# EAGLE design ADC Cubesat v1.1 (EAGLE 9.0.0)
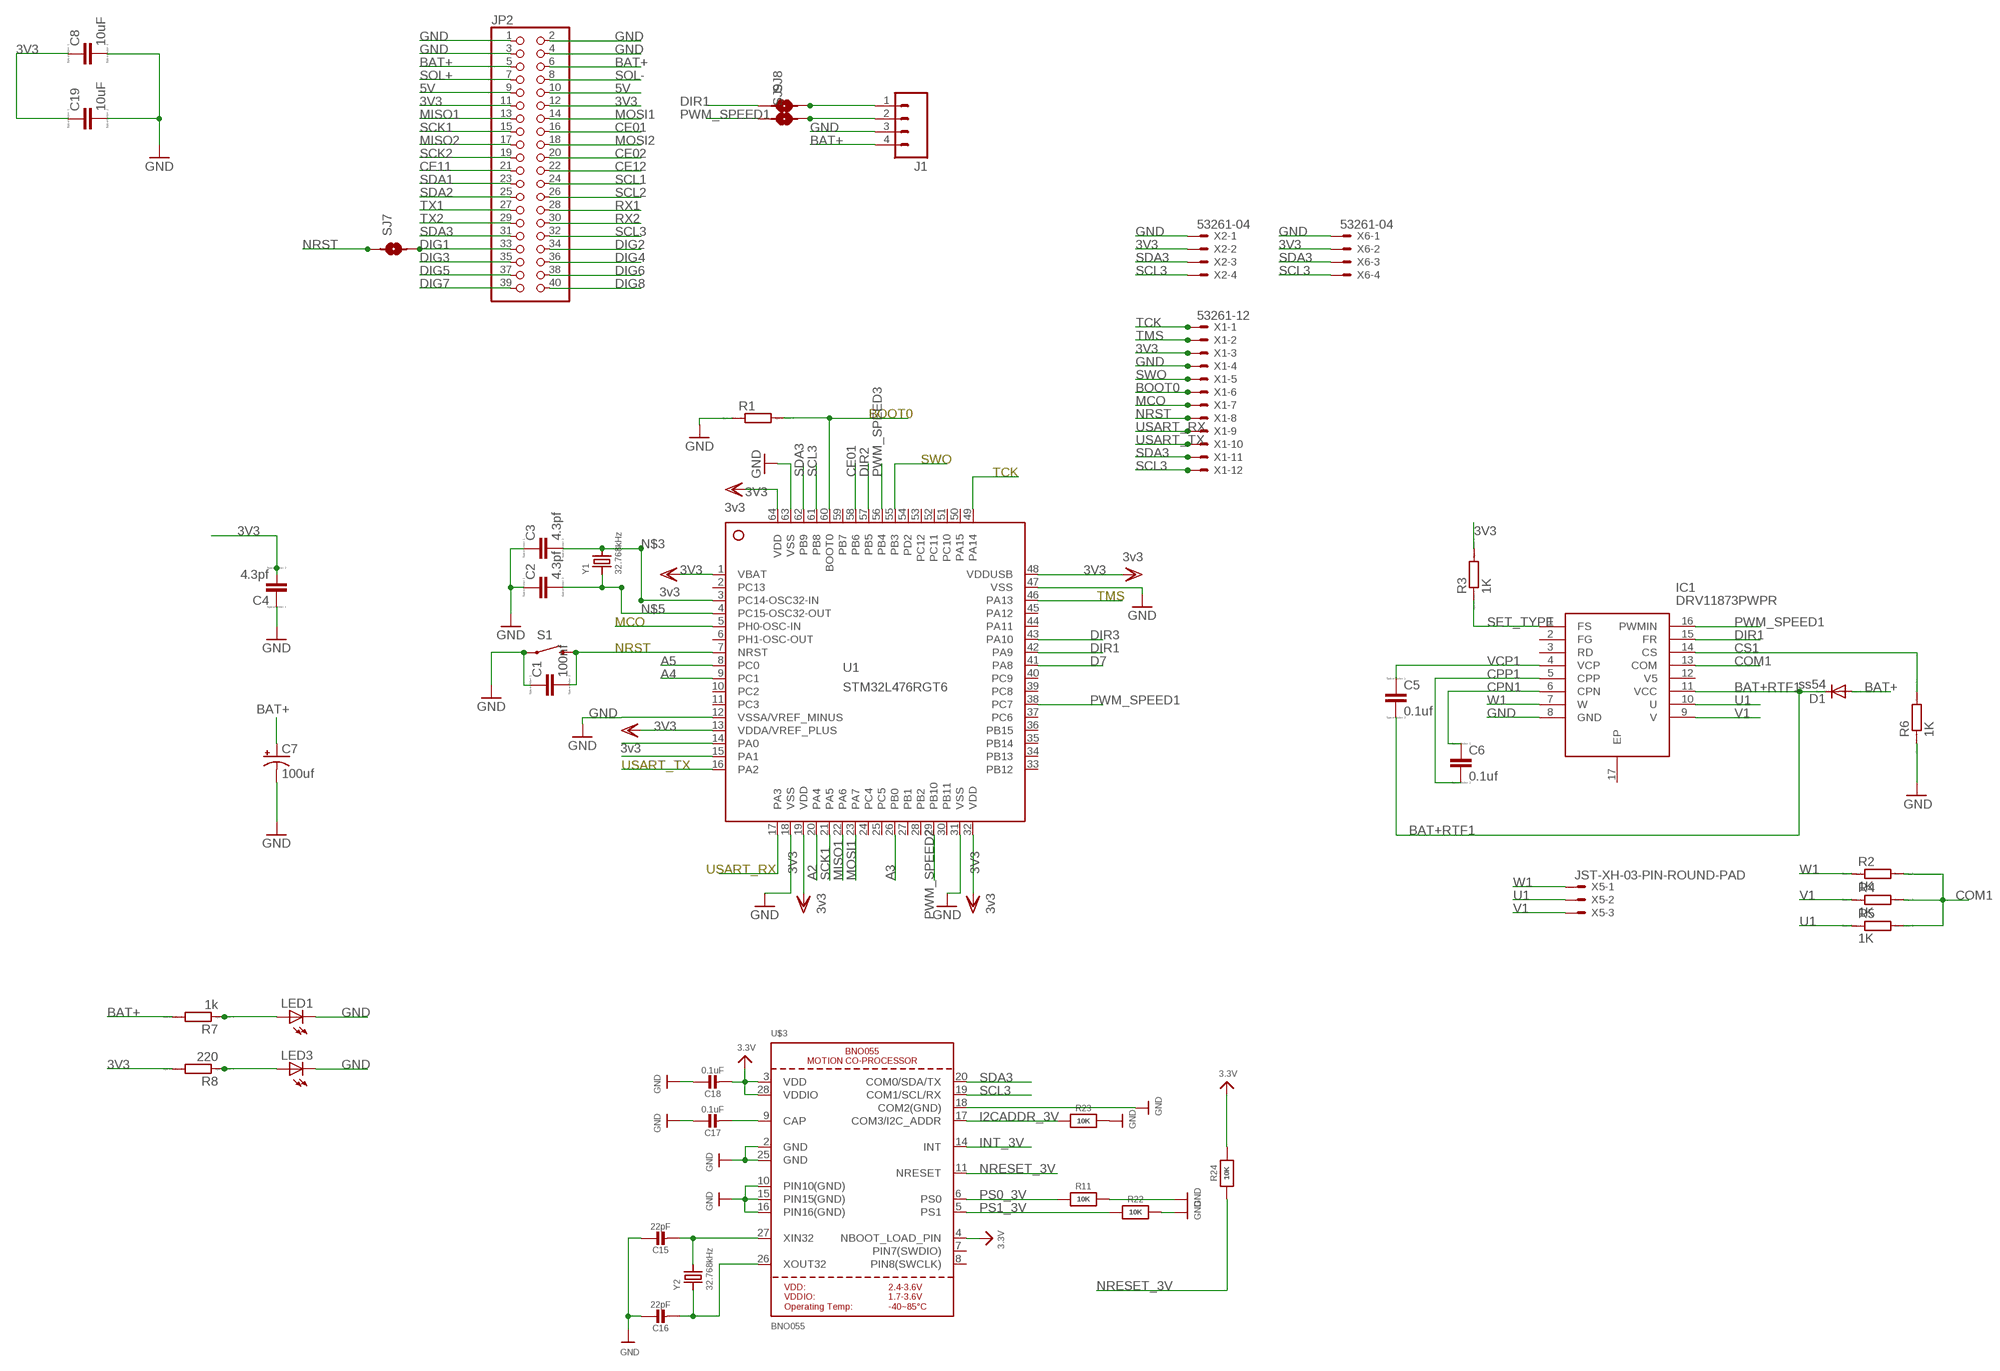
[diagram p0: schematic, sheet 1, part 1 of 2]
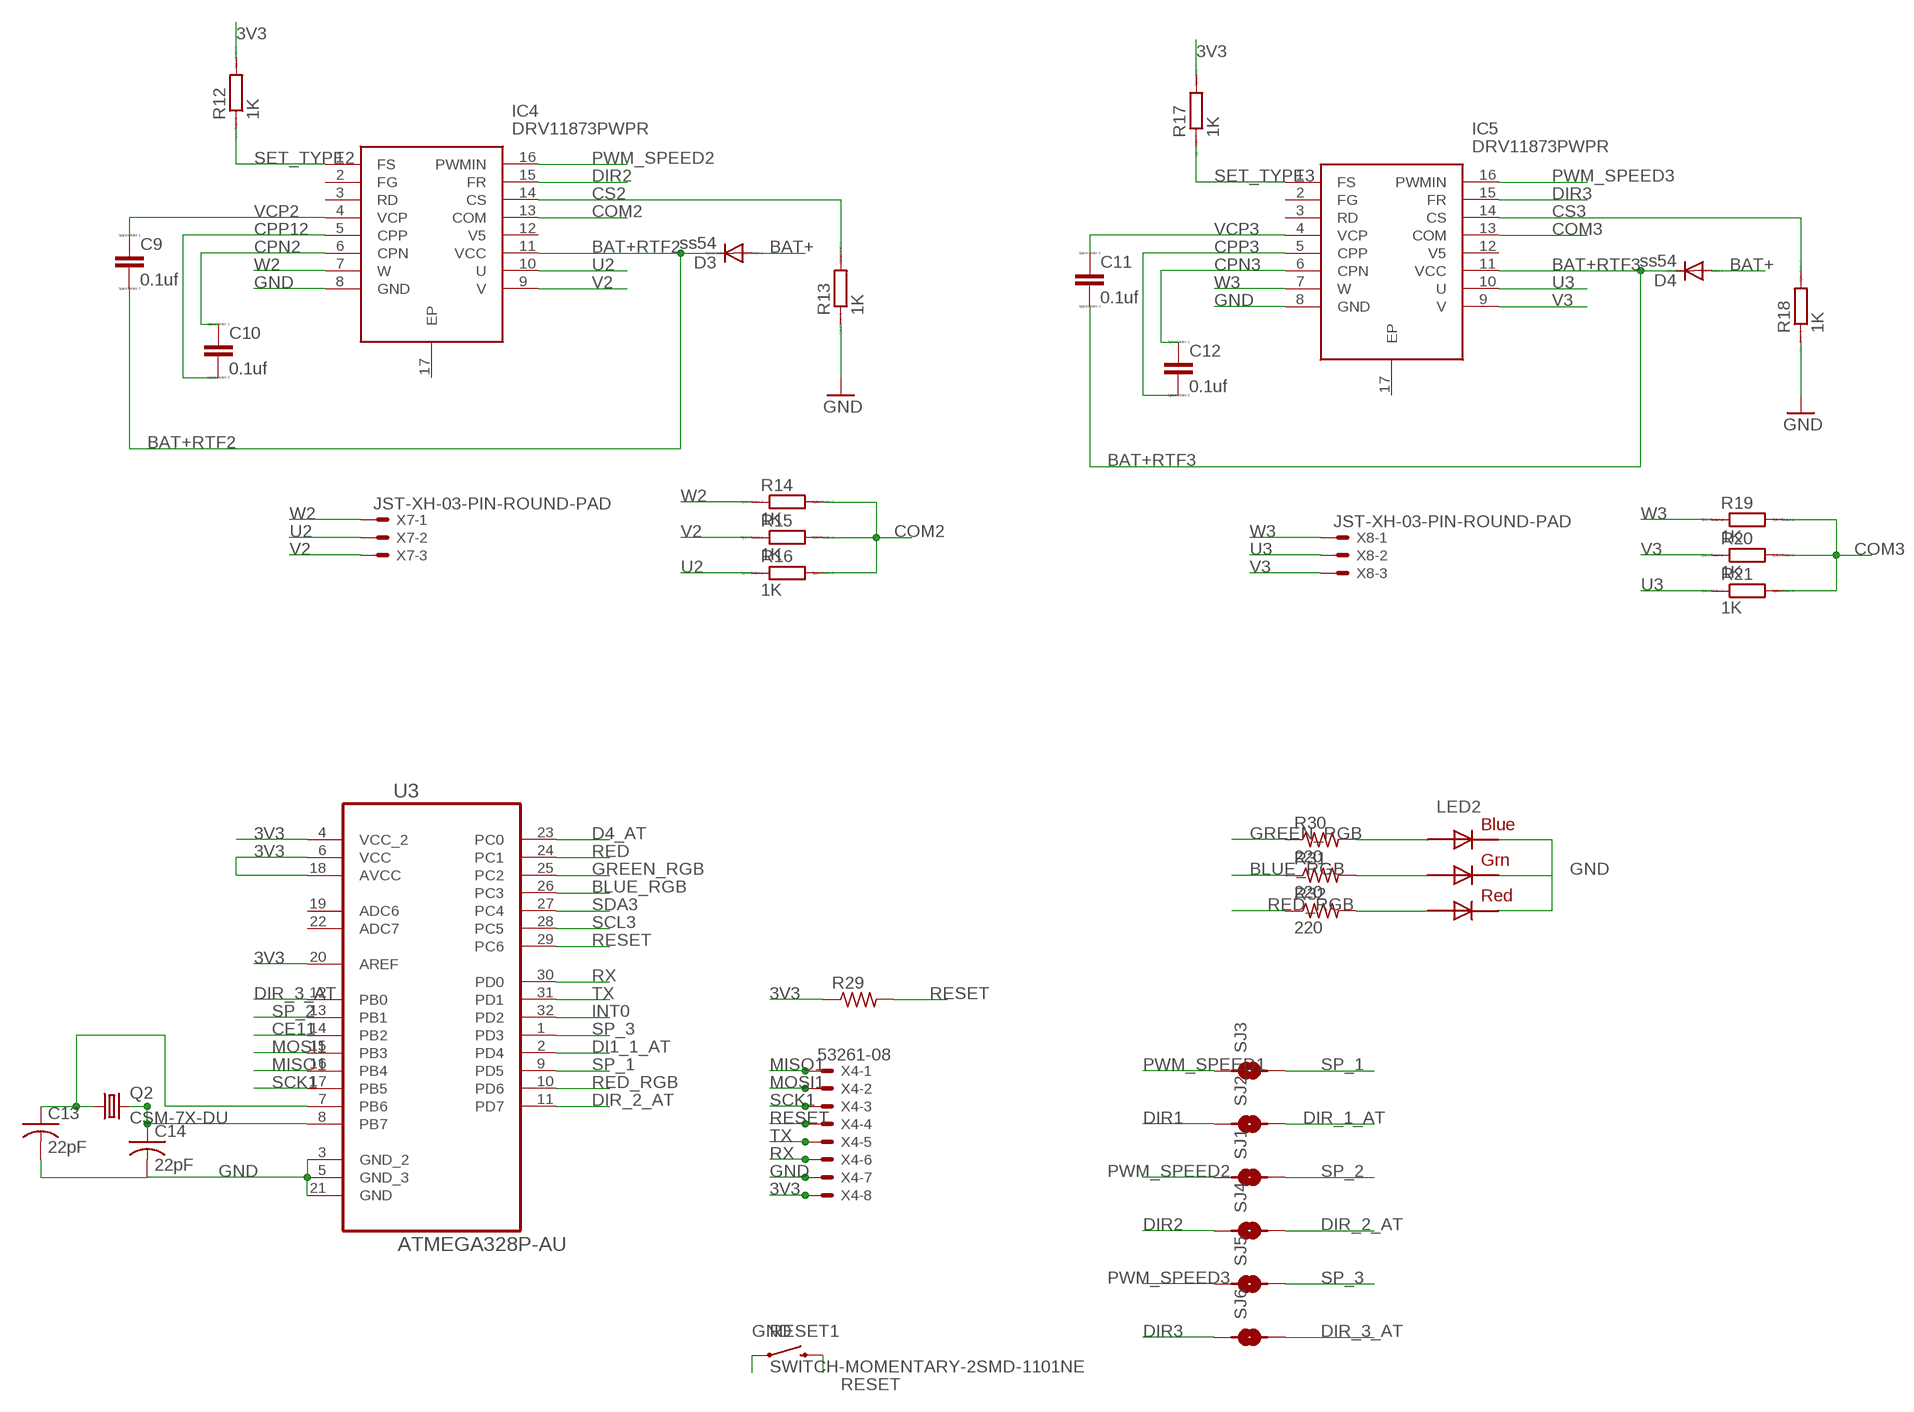
[diagram p1: schematic, sheet 1, part 2 of 2]

## Parts
C1  100nf  CC1206  [C1206]
C2  4.3pf  CC1206  [C1206]
C3  4.3pf  CC1206  [C1206]
C4  4.3pf  CC1206  [C1206]
C5  0.1uf  CC1210  [C1210]
C6  0.1uf  CC1210  [C1210]
C7  100uf  CAP_POLC  [PANASONIC_C]
C8  10uF  CC1206  [C1206]
C9  0.1uf  CC1210  [C1210]
C10  0.1uf  CC1210  [C1210]
C11  0.1uf  CC1210  [C1210]
C12  0.1uf  CC1210  [C1210]
C13  22pF  C-USC0603  [C0603]
C14  22pF  C-USC0603  [C0603]
C15  22pF  CAP_CERAMIC0805-NOOUTLINE  [0805-NO]
C16  22pF  CAP_CERAMIC0805-NOOUTLINE  [0805-NO]
C17  0.1uF  CAP_CERAMIC0805-NOOUTLINE  [0805-NO]
C18  0.1uF  CAP_CERAMIC0805_10MGAP  [0805_10MGAP]
C19  10uF  CC1206  [C1206]
D1  ss54  DIODE-DO-214AC  [DO-214AC]
D3  ss54  DIODE-DO-214AC  [DO-214AC]
D4  ss54  DIODE-DO-214AC  [DO-214AC]
IC1  DRV11873PWPR  [SOP65P640X120-17N]
IC4  DRV11873PWPR  [SOP65P640X120-17N]
IC5  DRV11873PWPR  [SOP65P640X120-17N]
J1  M04JST-PTH-VERT  [JST-4-PTH-VERT]
JP2  PINHD-2X20  [2X20]
LED1  LEDSML1206  [SML1206]
LED2  RGBLED5050  [RGBLED5050]
LED3  LEDSML1206  [SML1206]
Q2  CSM-7X-DU  [CSM-7X-DU]
R1  RR1206  [R1206]
R2  1K  RR1206  [R1206]
R3  1K  RR1206  [R1206]
R4  1K  RR1206  [R1206]
R5  1K  RR1206  [R1206]
R6  1K  RR1206  [R1206]
R7  1k  RR1206  [R1206]
R8  220  RR1206  [R1206]
R11  10K  RESISTOR0805_NOOUTLINE  [0805-NO]
R12  1K  RR1206  [R1206]
R13  1K  RR1206  [R1206]
R14  1K  RR1206  [R1206]
R15  1K  RR1206  [R1206]
R16  1K  RR1206  [R1206]
R17  1K  RR1206  [R1206]
R18  1K  RR1206  [R1206]
R19  1K  RR1206  [R1206]
R20  1K  RR1206  [R1206]
R21  1K  RR1206  [R1206]
R22  10K  RESISTOR0805_NOOUTLINE  [0805-NO]
R23  10K  RESISTOR0805_NOOUTLINE  [0805-NO]
R24  10K  RESISTOR0805_NOOUTLINE  [0805-NO]
R29  R-US_M1206  [M1206]
R30  220  R-US_R0603  [R0603]
R31  220  R-US_R0603  [R0603]
R32  220  R-US_R0603  [R0603]
RESET1  SWITCH-MOMENTARY-2SMD-1101NE  [TACTILE-SWITCH-1101NE]
S1  .  SWITCH-MOMENTARY-2SMD-1101NE  [TACTILE-SWITCH-1101NE]
SJ1  SMD-JUMPER-2  [SMD-JUMPER-2]
SJ2  SMD-JUMPER-2  [SMD-JUMPER-2]
SJ3  SMD-JUMPER-2  [SMD-JUMPER-2]
SJ4  SMD-JUMPER-2  [SMD-JUMPER-2]
SJ5  SMD-JUMPER-2  [SMD-JUMPER-2]
SJ6  SMD-JUMPER-2  [SMD-JUMPER-2]
SJ7  SMD-JUMPER-2  [SMD-JUMPER-2]
SJ8  SMD-JUMPER-2  [SMD-JUMPER-2]
SJ9  SMD-JUMPER-2  [SMD-JUMPER-2]
U1  STM32L476RGT6  [LQFP64_10X10]
U3  ATMEGA328P-AU  [QFP80P900X900X120-32N]
U$3  BNO055  [BNO055]
X1  53261-12  [53261-12]
X2  53261-04  [53261-04]
X4  53261-08  [53261-08]
X5  JST-XH-03-PIN-ROUND-PAD  [JST-XH-03-PACKAGE-ROUND-PAD]
X6  53261-04  [53261-04]
X7  JST-XH-03-PIN-ROUND-PAD  [JST-XH-03-PACKAGE-ROUND-PAD]
X8  JST-XH-03-PIN-ROUND-PAD  [JST-XH-03-PACKAGE-ROUND-PAD]
Y1  32.768kHz  CRYSTAL8.0X3.8  [CRYSTAL_8X3.8]
Y2  32.768kHz  CRYSTAL8.0X3.8  [CRYSTAL_8X3.8]

## Nets
3V3: C4.2 C8.1 C18.2 C19.1 JP2.11 JP2.12 R3.2 R8.2 R12.2 R17.2 R24.2 R29.1 U1.1(VBAT) U1.13(VDDA/VREF_PLUS) U1.19(VDD) U1.32(VDD) U1.48(VDDUSB) U1.64(VDD) U3.4(VCC_2) U3.6(VCC) U3.18(AVCC) U3.20(AREF) U$3.3(VDD) U$3.4(NBOOT_LOAD_PIN) U$3.28(VDDIO) X1.3 X2.2 X4.8 X6.2 ; supply symbol labelled 3v3, 3.3V
5V: JP2.9 JP2.10
A2: U1.20(PA4)
A3: U1.26(PB0)
A4: U1.9(PC1)
A5: U1.8(PC0)
BAT+: C7.+ D1.A D3.A D4.A J1.4 JP2.5 JP2.6 R7.2
BAT+RTF1: C5.2 D1.C IC1.11(VCC)
BAT+RTF2: C9.2 D3.C IC4.11(VCC)
BAT+RTF3: C11.2 D4.C IC5.11(VCC)
BLUE_RGB: R31.1 U3.26(PC3)
BOOT0: R1.2 U1.60(BOOT0) X1.6
CE01: JP2.16 U1.58(PB6)
CE02: JP2.20
CE11: JP2.21 U3.14(PB2)
CE12: JP2.22
COM1: IC1.13(COM) R2.2 R4.2 R5.2
COM2: IC4.13(COM) R14.2 R15.2 R16.2
COM3: IC5.13(COM) R19.2 R20.2 R21.2
CPN1: C6.1 IC1.6(CPN)
CPN2: C10.1 IC4.6(CPN)
CPN3: C12.1 IC5.6(CPN)
CPP1: C6.2 IC1.5(CPP)
CPP3: C12.2 IC5.5(CPP)
CPP12: C10.2 IC4.5(CPP)
CS1: IC1.14(CS) R6.2
CS2: IC4.14(CS) R13.2
CS3: IC5.14(CS) R18.2
D4_AT: U3.23(PC0)
D7: U1.41(PA8)
DI1_1_AT: U3.2(PD4)
DIG1: JP2.33 SJ7.2
DIG2: JP2.34
DIG3: JP2.35
DIG4: JP2.36
DIG5: JP2.37
DIG6: JP2.38
DIG7: JP2.39
DIG8: JP2.40
DIR1: IC1.15(FR) SJ2.1 SJ8.1 U1.42(PA9)
DIR2: IC4.15(FR) SJ4.1 U1.57(PB5)
DIR3: IC5.15(FR) SJ6.1 U1.43(PA10)
DIR_1_AT: SJ2.2
DIR_2_AT: SJ4.2 U3.11(PD7)
DIR_3_AT: SJ6.2 U3.12(PB0)
GND: C1.1 C2.1 C3.1 C4.1 C7.- C8.2 C13.2 C14.2 C15.1 C16.1 C17.1 C18.1 C19.2 IC1.8(GND) IC4.8(GND) IC5.8(GND) J1.3 JP2.1 JP2.2 JP2.3 JP2.4 LED1.C LED2.4(BLUE_C) LED2.5(RED_C) LED2.6(GREEN_C) LED3.C R1.1 R6.1 R11.2 R13.1 R18.1 R22.2 RESET1.1 S1.1 U1.12(VSSA/VREF_MINUS) U1.18(VSS) U1.31(VSS) U1.47(VSS) U1.63(VSS) U3.3(GND_2) U3.5(GND_3) U3.21(GND) U$3.2(GND) U$3.10(PIN10(GND)) U$3.15(PIN15(GND)) U$3.16(PIN16(GND)) U$3.18(COM2(GND)) U$3.25(GND) X1.4 X2.1 X4.7 X6.1
GREEN_RGB: R30.1 U3.25(PC2)
I2CADDR_3V: R23.1 U$3.17(COM3/I2C_ADDR)
INT0: U3.32(PD2)
INT_3V: U$3.14(INT)
MCO: U1.5(PH0-OSC-IN) X1.7
MISO1: JP2.13 U1.22(PA6) U3.16(PB4) X4.1
MISO2: JP2.17
MOSI1: JP2.14 U1.23(PA7) U3.15(PB3) X4.2
MOSI2: JP2.18
N$1: U1.14(PA0)
N$2: U1.15(PA1)
N$3: C3.2 U1.3(PC14-OSC32-IN) Y1.P$4
N$4: J1.1 SJ8.2
N$5: C2.2 U1.4(PC15-OSC32-OUT) Y1.P$1
N$6: J1.2 SJ9.2
N$7: LED1.A R7.1
N$8: C14.1 Q2.2 U3.8(PB7)
N$9: C15.2 U$3.27(XIN32) Y2.P$4
N$10: C16.2 U$3.26(XOUT32) Y2.P$1
N$11: C17.2 U$3.9(CAP)
N$12: C13.1 Q2.1 U3.7(PB6)
N$13: LED2.3(BLUE_A) R30.2
N$14: LED2.1(GREEN_A) R31.2
N$15: LED2.2(RED_A) R32.2
N$16: LED3.A R8.1
NRESET_3V: R24.1 U$3.11(NRESET)
NRST: C1.2 S1.2 SJ7.1 U1.7(NRST) X1.8
PS0_3V: R11.1 U$3.6(PS0)
PS1_3V: R22.1 U$3.5(PS1)
PWM_SPEED1: IC1.16(PWMIN) SJ3.1 SJ9.1 U1.38(PC7)
PWM_SPEED2: IC4.16(PWMIN) SJ1.1 U1.29(PB10)
PWM_SPEED3: IC5.16(PWMIN) SJ5.1 U1.56(PB4)
RED: U3.24(PC1)
RED_RGB: R32.1 U3.10(PD6)
RESET: R29.2 RESET1.2 U3.29(PC6) X4.4
RX: U3.30(PD0) X4.6
RX1: JP2.28
RX2: JP2.30
SCK1: JP2.15 U1.21(PA5) U3.17(PB5) X4.3
SCK2: JP2.19
SCL1: JP2.24
SCL2: JP2.26
SCL3: JP2.32 U1.61(PB8) U3.28(PC5) U$3.19(COM1/SCL/RX) X1.12 X2.4 X6.4
SDA1: JP2.23
SDA2: JP2.25
SDA3: JP2.31 U1.62(PB9) U3.27(PC4) U$3.20(COM0/SDA/TX) X1.11 X2.3 X6.3
SET_TYPE: IC1.1(FS) R3.1
SET_TYPE2: IC4.1(FS) R12.1
SET_TYPE3: IC5.1(FS) R17.1
SOL+: JP2.7
SOL-: JP2.8
SP_1: SJ3.2 U3.9(PD5)
SP_2: SJ1.2 U3.13(PB1)
SP_3: SJ5.2 U3.1(PD3)
SWO: U1.55(PB3) X1.5
TCK: U1.49(PA14) X1.1
TMS: U1.46(PA13) X1.2
TX: U3.31(PD1) X4.5
TX1: JP2.27
TX2: JP2.29
U1: IC1.10(U) R5.1 X5.2
U2: IC4.10(U) R16.1 X7.2
U3: IC5.10(U) R21.1 X8.2
USART_RX: U1.17(PA3) X1.9
USART_TX: U1.16(PA2) X1.10
V1: IC1.9(V) R4.1 X5.3
V2: IC4.9(V) R15.1 X7.3
V3: IC5.9(V) R20.1 X8.3
VCP1: C5.1 IC1.4(VCP)
VCP2: C9.1 IC4.4(VCP)
VCP3: C11.1 IC5.4(VCP)
W1: IC1.7(W) R2.1 X5.1
W2: IC4.7(W) R14.1 X7.1
W3: IC5.7(W) R19.1 X8.1
Unconnected: IC1.2(FG) IC1.3(RD) IC1.12(V5) IC1.17(EP) IC4.2(FG) IC4.3(RD) IC4.12(V5) IC4.17(EP) IC5.2(FG) IC5.3(RD) IC5.12(V5) IC5.17(EP) R23.2 U1.2(PC13) U1.6(PH1-OSC-OUT) U1.10(PC2) U1.11(PC3) U1.24(PC4) U1.25(PC5) U1.27(PB1) U1.28(PB2) U1.30(PB11) U1.33(PB12) U1.34(PB13) U1.35(PB14) U1.36(PB15) U1.37(PC6) U1.39(PC8) U1.40(PC9) U1.44(PA11) U1.45(PA12) U1.50(PA15) U1.51(PC10) U1.52(PC11) U1.53(PC12) U1.54(PD2) U1.59(PB7) U3.19(ADC6) U3.22(ADC7) U$3.7(PIN7(SWDIO)) U$3.8(PIN8(SWCLK))

## Library data of the parts
C1-C6 C8-C12 C19 = eagle-ltspice:C: CAPACITOR, European symbol; SPICEMODEL: NONE; SPICEPREFIX: C
C7 = SparkFun-Capacitors:CAP_POL: Capacitor Polarized These are standard SMD and PTH capacitors. Normally 10uF, 47uF, and 100uF in electrolytic and tantalum varieties. Always verify the external diameter of the through hole cap, it varies with capacity, voltage, and manufacturer. The EIA devices should be standard.
C13 C14 = rcl:C-US: CAPACITOR, American symbol
C15-C18 = microbuilder:CAP_CERAMIC: Ceramic Capacitors For new designs, use the packages preceded by an '_' character since they are more reliable: The following footprints should be used on most boards: _0402 - Standard footprint for regular board layouts _0603 - Standard footprint for regular board layouts _0805 - Standard footprint for regular board layouts _1206 - Standard footprint for regular board layouts For extremely tight-pitch boards where space is at a premium, the following 'micro-pitch' footprints can be used (smaller pads, no silkscreen outline, etc.): _0402MP - Micro-pitch footprint for very dense/compact boards _0603MP - Micro-pitch footprint for very dense/compact boards _0805MP - Micro-pitch footprint for very dense/compact boards _1206MP - Micro-pitch footprint for very dense/compact boards
D1 D3 D4 = diode:DIODE-: DIODE
IC1 IC4 IC5 = DRV11873PWPR:DRV11873PWPR: 3-Ph Sensorless BLDC Motor Driver HTSSOP Texas Instruments DRV11873PWPR BLDC Motor Driver IC, 16 V 1.5A, 16-Pin HTSSOP Source: Datasheet <https://componentsearchengine.com/Datasheets/1/DRV11873PWPR.pdf>; ARROW_PART_NUMBER: DRV11873PWPR; ARROW_PRICE/STOCK: https://www.arrow.com/en/products/drv11873pwpr/texas-instruments; DESCRIPTION: 3-Ph Sensorless BLDC Motor Driver HTSSOP Texas Instruments DRV11873PWPR BLDC Motor Driver IC, 16 V 1.5A, 16-Pin HTSSOP; HEIGHT: 1.2mm; MANUFACTURER_NAME: Texas Instruments; MANUFACTURER_PART_NUMBER: DRV11873PWPR; RS_PART_NUMBER: 1627666; RS_PRICE/STOCK: http://uk.rs-online.com/web/p/products/1627666
J1 = SparkFun-Connectors:M04: Header 4 Standard 4-pin 0.1" header. Use with straight break away headers (SKU : PRT-00116), right angle break away headers (PRT-00553), swiss pins (PRT-00743), machine pins (PRT-00117), and female headers (PRT-00115). Molex polarized connector foot print use with SKU : PRT-08231 with associated crimp pins and housings. 1MM SMD Version SKU: PRT-10208; PROD_ID: CONN-13251
JP2 = pinhead:PINHD-2X20: PIN HEADER
LED1 LED3 = led:LED: LED OSRAM: - CHIPLED LG R971, LG N971, LY N971, LG Q971, LY Q971, LO R971, LY R971 LH N974, LH R974 LS Q976, LO Q976, LY Q976 LO Q996 - Hyper CHIPLED LW Q18S LB Q993, LB Q99A, LB R99A - SideLED LS A670, LO A670, LY A670, LG A670, LP A670 LB A673, LV A673, LT A673, LW A673 LH A674 LY A675 LS A676, LA A676, LO A676, LY A676, LW A676 LS A679, LY A679, LG A679 - Hyper Micro SIDELED® LS Y876, LA Y876, LO Y876, LY Y876 LT Y87S - SmartLED LW L88C, LW L88S LB L89C, LB L89S, LG L890 LS L89K, LO L89K, LY L89K LS L896, LA L896, LO L896, LY L896 - TOPLED LS T670, LO T670, LY T670, LG T670, LP T670 LSG T670, LSP T670, LSY T670, LOP T670, LYG T670 LG T671, LOG T671, LSG T671 LB T673, LV T673, LT T673, LW T673 LH T674 LS T676, LA T676, LO T676, LY T676, LB T676, LH T676, LSB T676, LW T676 LB T67C, LV T67C, LT T67C, LS T67K, LO T67K, LY T67K, LW E67C LS E67B, LA E67B, LO E67B, LY E67B, LB E67C, LV E67C, LT E67C LW T67C LS T679, LY T679, LG T679 LS T770, LO T770, LY T770, LG T770, LP T770 LB T773, LV T773, LT T773, LW T773 LH T774 LS E675, LA E675, LY E675, LS T675 LS T776, LA T776, LO T776, LY T776, LB T776 LHGB T686 LT T68C, LB T68C - Hyper Mini TOPLED® LB M676 - Mini TOPLED Santana® LG M470 LS M47K, LO M47K, LY M47K Source: http://www.osram.convergy.de LUXEON: - LUMILED® LXK2-PW12-R00, LXK2-PW12-S00, LXK2-PW14-U00, LXK2-PW14-V00 LXK2-PM12-R00, LXK2-PM12-S00, LXK2-PM14-U00 LXK2-PE12-Q00, LXK2-PE12-R00, LXK2-PE12-S00, LXK2-PE14-T00, LXK2-PE14-U00 LXK2-PB12-K00, LXK2-PB12-L00, LXK2-PB12-M00, LXK2-PB14-N00, LXK2-PB14-P00, LXK2-PB14-Q00 LXK2-PR12-L00, LXK2-PR12-M00, LXK2-PR14-Q00, LXK2-PR14-R00 LXK2-PD12-Q00, LXK2-PD12-R00, LXK2-PD12-S00 LXK2-PH12-R00, LXK2-PH12-S00 LXK2-PL12-P00, LXK2-PL12-Q00, LXK2-PL12-R00 Source: www.luxeon.com KINGBRIGHT: KA-3528ASYC Source: www.kingbright.com
LED2 = adafruit:RGBLED: For 5050 RGB LEDs, the order of the LEDs may vary from one manufacturer to another!
Q2 = crystal:CSM-7X-DU: SMD CRYSTAL Source: www.ecsxtal.com .. Crystal 3.6864MHz CSM_7X_DU.PDF; OC_FARNELL: unknown; OC_NEWARK: unknown
R1-R8 R12-R21 = eagle-ltspice:R: RESISTOR, European symbol; SPICEMODEL: NONE; SPICEPREFIX: R
R11 R22-R24 = microbuilder:RESISTOR: Resistors For new designs, use the packages preceded by an '_' character since they are more reliable: The following footprints should be used on most boards: _0402 - Standard footprint for regular board layouts _0603 - Standard footprint for regular board layouts _0805 - Standard footprint for regular board layouts _1206 - Standard footprint for regular board layouts For extremely tight-pitch boards where space is at a premium, the following 'micro-pitch' footprints can be used (smaller pads, no silkscreen outline, etc.): _0402MP - Micro-pitch footprint for very dense/compact boards _0603MP - Micro-pitch footprint for very dense/compact boards _0805MP - Micro-pitch footprint for very dense/compact boards _1206MP - Micro-pitch footprint for very dense/compact boards
R29-R32 = adafruit:R-US_: RESISTOR, American symbol
RESET1 S1 = SparkFun-Electromechanical:SWITCH-MOMENTARY-2: Various NO switches- pushbuttons, reed, etc; PROD_ID: SWCH-00815
SJ1-SJ9 = FaBo-etc:SMD-JUMPER-2
U1 = STM32L4xxx:STM32L476R*: STM32L476RX LQFP100 Datasheet STM32L476XX <http://www.st.com/content/ccc/resource/technical/document/datasheet/c5/ed/2f/60/aa/79/42/0b/DM00108832.pdf/files/DM00108832.pdf/jcr:content/translations/en.DM00108832.pdf>; FARNELL: 2494460; FLASH: 1024kB; SRAM: 128kB
U3 = Atmel_By_element14_Batch_1-00:ATMEGA328P-AU: 8-bit Microcontroller with In-System Programmable Flash; MPN: ATMEGA328P-AU; OC_FARNELL: 1715486; OC_NEWARK: 14R4631; PACKAGE: TQFP-32; SUPPLIER: Atmel
U$3 = microbuilder:BNO055: BNO055 - Motion Co-Processor
X1 = con-molex:53?-12: CONNECTOR wire to board 1.25 mm (.049 inch) pitch header; MF: MOLEX; MPN: 53261-1271; OC_FARNELL: 1125363; OC_NEWARK: 59J0244
X2 X6 = con-molex:53?-04: CONNECTOR wire to board 1.25 mm (.049 inch) pitch header; MF: MOLEX; OC_FARNELL: 1125374; OC_NEWARK: unknown
X4 = con-molex:53?-08: CONNECTOR wire to board 1.25 mm (.049 inch) pitch header; MF: MOLEX; OC_FARNELL: 1125376; OC_NEWARK: unknown
X5 X7 X8 = Rembrandt Electronics - JST XH Connectors v1-0:JST-XH-03-PIN: JST XH Connector 2 Pin Wire to board connector. Pitch: 2,54 mm, (0.100") Number of pins: 3 Created by Rembrandt Electronics www.rembrandtelectronics.com
Y1 Y2 = microbuilder:CRYSTAL: Crystals HC49UP - Surface Mount Crystal 4.0MHz 18pF +/-30ppm Surface Mount Crystal [Digikey: 535-9857-1-ND] 12.0 MHz Surface Mount Crystal [Digikey: 535-9869-6-ND] 25.0 MHz Surface Mount Crystal [Digikey: 535-9078-1-ND] 2.5 x 2.0mm - MEMs SMT Crystal 16.0 MHz 10pF 20ppm 2.5 x 2.0mm Crystal [Digikey -40-85°C: 535-10923-1-ND] 3.2 x 2.5mm - MEMs SMT Crystal 12.0 MHz 8pF 15ppm 3.2 x 2.5mm Crystal [Digikey: -10-70°C: 644-1047-1-ND -40-125°C: 644-1128-1-ND] 40~85°C cheaper: 644-1173-6-ND 16.0 MHz 8pF 15ppm 3.2 x 2.5mm Crystal [Digikey: -10-70°C: 644-1049-1-ND -40-125°C: 644-1129-2-ND]-40~85°C cheaper: 644-1175-6-ND 16.0 MHz 10pF 10ppm 3.2 x 2.5mm Crystal [Digikey: 644-1100-1-ND] 27.12 MHz 18pF 30ppm 3.2 x 2.5mm Crystal [Digikey: 887-1424-1-ND] 27.12MHz 10pF 10ppm 3.2 x 2.5mm Crystal [Digikey: 887-1329-1-ND] 4.9 x 1.8mm - MEMs SMT Crystal 32.768 KHz 12.5pF 20ppm 4.9 x 1.8mm Crystal [Digikey: SE2415CT-ND] 8.0 x 3.8mm - Surface Mount Crystal 32.768kHz 12.5pF 20ppm -40°C-85°C [Digikey: 535-9166-2-ND] Cylinder 32.768KHz Cylinder Crystal (2x6mm body) [Ex. Digikey: 300-8341-2-ND]

## Board
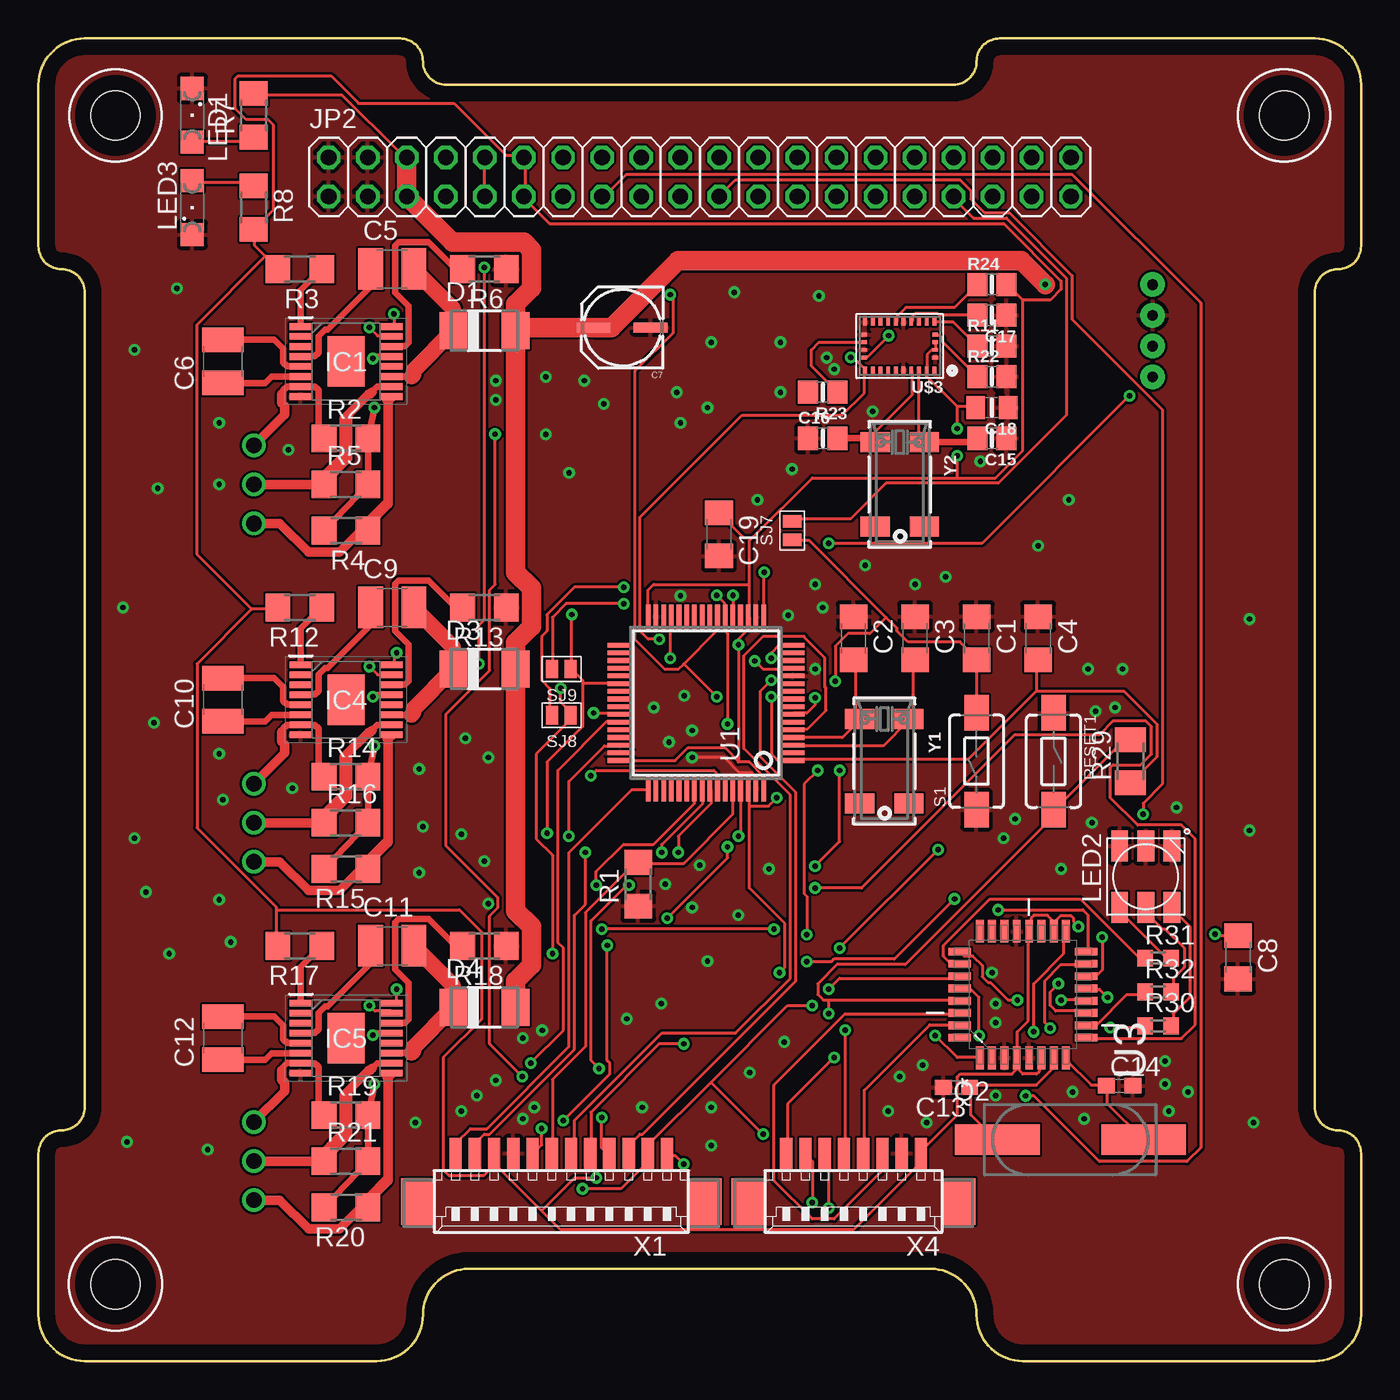
[diagram p2: board, top side]
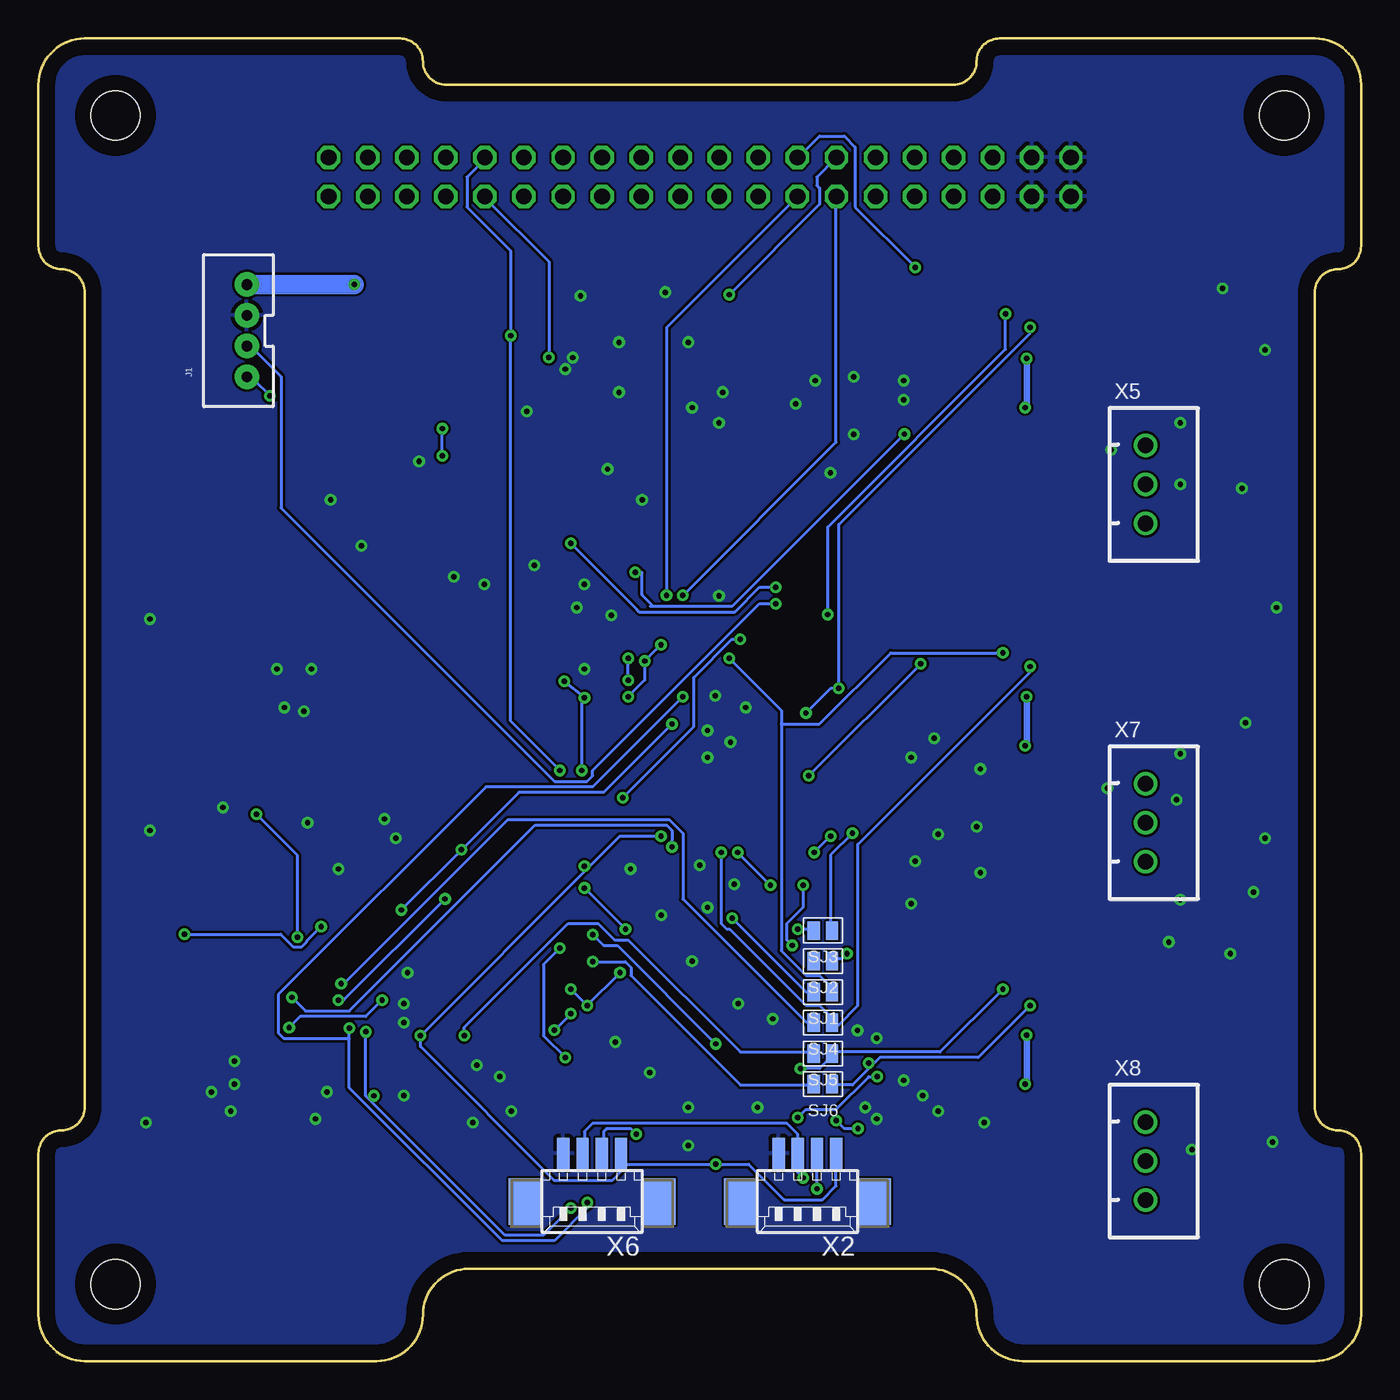
[diagram p3: board, bottom side, seen from below]

Size 86 x 86 mm. Coordinates in mm from the lower left corner, seen from the top.
Outline: 0,83 0,72.5 arc90 1.5,71 arc-90 3,69.5 3,16.5 arc-90 1.5,15 arc90 0,13.5 0,3 arc90 3,0 22,0 arc90 25,3 arc-90 28,6 58,6 arc-90 61,3 arc90 64,0 83,0 arc90 86,3 86,13.5 arc90 84.5,15 arc-90 83,16.5 83,69.5 arc-90 84.5,71 arc90 86,72.5 86,83 arc90 83,86 62.5,86 arc90 61,84.5 arc-90 59.5,83 26.5,83 arc-90 25,84.5 arc90 23.5,86 3,86 arc90 0,83
Copper layers (1*16): Top 0.035mm / dielectric 1.5mm / Bottom 0.035mm
Design rules "default *": minimum track width 8mil, minimum drill 0.35mm, track to track 6mil, track to pad 6mil, pad to pad 6mil, via to via 6mil, smd to smd 6mil, copper to edge 40mil, drill to drill 8mil, minimum pad ring 10mil, minimum via ring 8mil, stop-mask expansion 100mil, vias tented up to drill 20mil, thermal gap 10mil
Holes 3.2 mm at 5,5 81,5 81,81 5,81

### Footprints (pad centres in the part's own frame; a part is rotated, then mirrored left to right if it is on the bottom)
C1206 = smd 1.6 x 1.8: 1 -1.4,0; 2 1.4,0
C1210 = smd 1.6 x 2.7: 1 -1.4,0; 2 1.4,0
PANASONIC_C = smd 2.2 x 0.65: + 1.9,-0.2; - -1.8,-0.2
C0603 = smd 1.1 x 1: 1 -0.85,0; 2 0.85,0
0805-NO = smd 1.3 x 1.5: 1 -0.95,0; 2 0.95,0
0805_10MGAP = smd 1.2 x 1.5: 1 -1.05,0; 2 1.05,0
DO-214AC = smd 1.8 x 2.4: A 2.025,0; C -2.025,0
SOP65P640X120-17N = smd 1.475 x 0.45: 1 -2.938,2.275; 2 -2.938,1.625; 3 -2.938,0.975; 4 -2.938,0.325; 5 -2.938,-0.325; 6 -2.938,-0.975; 7 -2.938,-1.625; 8 -2.938,-2.275; 9 2.938,-2.275; 10 2.938,-1.625; 11 2.938,-0.975; 12 2.938,-0.325; 13 2.938,0.325; 14 2.938,0.975; 15 2.938,1.625; 16 2.938,2.275 | smd 2.41 x 3.29: 17 0,0
JST-4-PTH-VERT = drill 0.7 pad 1.6: 1 -3,-0.55; 2 -1,-0.55; 3 1,-0.55; 4 3,-0.55
2X20 = drill 1.016 octagon: 1 -24.13,-1.27; 2 -24.13,1.27; 3 -21.59,-1.27; 4 -21.59,1.27; 5 -19.05,-1.27; 6 -19.05,1.27; 7 -16.51,-1.27; 8 -16.51,1.27; 9 -13.97,-1.27; 10 -13.97,1.27; 11 -11.43,-1.27; 12 -11.43,1.27; 13 -8.89,-1.27; 14 -8.89,1.27; 15 -6.35,-1.27; 16 -6.35,1.27; 17 -3.81,-1.27; 18 -3.81,1.27; 19 -1.27,-1.27; 20 -1.27,1.27; 21 1.27,-1.27; 22 1.27,1.27; 23 3.81,-1.27; 24 3.81,1.27; 25 6.35,-1.27; 26 6.35,1.27; 27 8.89,-1.27; 28 8.89,1.27; 29 11.43,-1.27; 30 11.43,1.27; 31 13.97,-1.27; 32 13.97,1.27; 33 16.51,-1.27; 34 16.51,1.27; 35 19.05,-1.27; 36 19.05,1.27; 37 21.59,-1.27; 38 21.59,1.27; 39 24.13,-1.27; 40 24.13,1.27
SML1206 = smd 1.5 x 1.5: A 1.75,0; C -1.75,0
RGBLED5050 = smd 2 x 1.1: 1 -2,1.7; 2 -2,0; 3 -2,-1.7; 4 2,-1.7; 5 2,0; 6 2,1.7
CSM-7X-DU = smd 5.5 x 2: 1 -4.75,0; 2 4.75,0
R1206 = smd 1.6 x 1.803: 1 -1.422,0; 2 1.422,0
M1206 = smd 1.6 x 2: 1 -1.4,0; 2 1.4,0
R0603 = smd 1 x 1.1: 1 -0.85,0; 2 0.85,0
TACTILE-SWITCH-1101NE = smd 2.3 x 1.6: 1 -3.15,0; 2 3.15,0
SMD-JUMPER-2 = smd 0.8 x 1.2: 1 -0.6,0; 2 0.6,0
LQFP64_10X10 = smd 0.3 x 1.6: 1 -3.75,-5.6; 2 -3.25,-5.6; 3 -2.75,-5.6; 4 -2.25,-5.6; 5 -1.75,-5.6; 6 -1.25,-5.6; 7 -0.75,-5.6; 8 -0.25,-5.6; 9 0.25,-5.6; 10 0.75,-5.6; 11 1.25,-5.6; 12 1.75,-5.6; 13 2.25,-5.6; 14 2.75,-5.6; 15 3.25,-5.6; 16 3.75,-5.6; 33 3.75,5.6; 34 3.25,5.6; 35 2.75,5.6; 36 2.25,5.6; 37 1.75,5.6; 38 1.25,5.6; 39 0.75,5.6; 40 0.25,5.6; 41 -0.25,5.6; 42 -0.75,5.6; 43 -1.25,5.6; 44 -1.75,5.6; 45 -2.25,5.6; 46 -2.75,5.6; 47 -3.25,5.6; 48 -3.75,5.6 | smd 1.6 x 0.3: 17 5.6,-3.75; 18 5.6,-3.25; 19 5.6,-2.75; 20 5.6,-2.25; 21 5.6,-1.75; 22 5.6,-1.25; 23 5.6,-0.75; 24 5.6,-0.25; 25 5.6,0.25; 26 5.6,0.75; 27 5.6,1.25; 28 5.6,1.75; 29 5.6,2.25; 30 5.6,2.75; 31 5.6,3.25; 32 5.6,3.75; 49 -5.6,3.75; 50 -5.6,3.25; 51 -5.6,2.75; 52 -5.6,2.25; 53 -5.6,1.75; 54 -5.6,1.25; 55 -5.6,0.75; 56 -5.6,0.25; 57 -5.6,-0.25; 58 -5.6,-0.75; 59 -5.6,-1.25; 60 -5.6,-1.75; 61 -5.6,-2.25; 62 -5.6,-2.75; 63 -5.6,-3.25; 64 -5.6,-3.75
QFP80P900X900X120-32N = smd 1.473 x 0.508: 1 -4.115,2.794; 2 -4.115,2.007; 3 -4.115,1.194; 4 -4.115,0.406; 5 -4.115,-0.406; 6 -4.115,-1.194; 7 -4.115,-2.007; 8 -4.115,-2.794; 17 4.115,-2.794; 18 4.115,-2.007; 19 4.115,-1.194; 20 4.115,-0.406; 21 4.115,0.406; 22 4.115,1.194; 23 4.115,2.007; 24 4.115,2.794 | smd 0.508 x 1.473: 9 -2.794,-4.115; 10 -2.007,-4.115; 11 -1.194,-4.115; 12 -0.406,-4.115; 13 0.406,-4.115; 14 1.194,-4.115; 15 2.007,-4.115; 16 2.794,-4.115; 25 2.794,4.115; 26 2.007,4.115; 27 1.194,4.115; 28 0.406,4.115; 29 -0.406,4.115; 30 -1.194,4.115; 31 -2.007,4.115; 32 -2.794,4.115
BNO055 = smd 0.25 x 0.475: 1 -2.25,1.562; 6 -2.25,-1.562; 7 -1.75,-1.562; 8 -1.25,-1.562; 9 -0.75,-1.562; 10 -0.25,-1.562; 11 0.25,-1.562; 12 0.75,-1.562; 13 1.25,-1.562; 14 1.75,-1.562; 15 2.25,-1.562; 20 2.25,1.562; 21 1.75,1.562; 22 1.25,1.562; 23 0.75,1.562; 24 0.25,1.562; 25 -0.25,1.562; 26 -0.75,1.562; 27 -1.25,1.562; 28 -1.75,1.562 | smd 0.375 x 0.25: 2 -2.312,0.75; 3 -2.312,0.25; 4 -2.312,-0.25; 5 -2.312,-0.75; 16 2.312,-0.75; 17 2.312,-0.25; 18 2.312,0.25; 19 2.312,0.75
53261-12 = smd 0.8 x 2: 1 6.875,-2.5; 2 5.625,-2.5; 3 4.375,-2.5; 4 3.125,-2.5; 5 1.875,-2.5; 6 0.625,-2.5; 7 -0.625,-2.5; 8 -1.875,-2.5; 9 -3.125,-2.5; 10 -4.375,-2.5; 11 -5.625,-2.5; 12 -6.875,-2.5 | smd 2.1 x 3: S1 9.375,0.625; S2 -9.375,0.625
53261-04 = smd 0.8 x 2: 1 1.875,-2.5; 2 0.625,-2.5; 3 -0.625,-2.5; 4 -1.875,-2.5 | smd 2.1 x 3: S1 4.375,0.625; S2 -4.375,0.625
53261-08 = smd 0.8 x 2: 1 4.375,-2.5; 2 3.125,-2.5; 3 1.875,-2.5; 4 0.625,-2.5; 5 -0.625,-2.5; 6 -1.875,-2.5; 7 -3.125,-2.5; 8 -4.375,-2.5 | smd 2.1 x 3: S1 6.875,0.625; S2 -6.875,0.625
JST-XH-03-PACKAGE-ROUND-PAD = drill 1.016: 1 -2.54,0; 2 0,0; 3 2.54,0
CRYSTAL_8X3.8 = smd 1.3 x 1.9: P$1 -2.75,-1.6; P$2 2.75,-1.6; P$3 2.75,1.6; P$4 -2.75,1.6

### Placement (x,y rotation side)
C1  61,47 270 top
C2  53,47 270 top
C3  57,47 270 top
C4  65,47 270 top
C5  23,71 0 top
C6  12,65 90 top
C7  38,67 180 top
C8  78,26.25 270 top
C9  23,49 0 top
C10  12,43 90 top
C11  23,27 0 top
C12  12,21 90 top
C13  59.7,17.8 180 top
C14  70.3,17.9 0 top
C15  62,60 180 top
C16  51,60 0 top
C17  62,68 180 top
C18  62,62 180 top
C19  44.25,53.75 270 top
D1  29,67 0 top
D3  29,45 0 top
D4  29,23 0 top
IC1  20,65 0 top
IC4  20,43 0 top
IC5  20,21 0 top
J1  73,67 90 bottom
JP2  43,77 0 top
LED1  10,81 270 top
LED2  72,31.5 90 top
LED3  10,75 90 top
Q2  67.1,14.4 0 top
R1  39,31 90 top
R2  20,60 0 top
R3  17,71 180 top
R4  20,54 180 top
R5  20,57 0 top
R6  29,71 180 top
R7  14,81 90 top
R8  14,75 270 top
R11  62,66 0 top
R12  17,49 180 top
R13  29,49 180 top
R14  20,38 0 top
R15  20,32 180 top
R16  20,35 0 top
R17  17,27 180 top
R18  29,27 180 top
R19  20,16 0 top
R20  20,10 180 top
R21  20,13 0 top
R22  62,64 0 top
R23  51,63 180 top
R24  62,70 0 top
R29  71,39 90 top
R30  72.8,21.8 0 top
R31  72.8,26.2 0 top
R32  72.8,24 0 top
RESET1  66,39 270 top
S1  61,39 90 top
SJ1  35,24 180 bottom
SJ2  35,26 180 bottom
SJ3  35,28 180 bottom
SJ4  35,22 180 bottom
SJ5  35,20 180 bottom
SJ6  35,18 180 bottom
SJ7  49,54 90 top
SJ8  34,42 180 top
SJ9  34,45 180 top
U1  43.4,42.8 90 top
U3  64.01,23.83 90 top
U$3  56,66 180 top
X1  34,11 180 top
X2  36,11 180 bottom
X4  53,11 180 top
X5  14,57 270 bottom
X6  50,11 180 bottom
X7  14,35 270 bottom
X8  14,13 270 bottom
Y1  55,39 270 top
Y2  56,57 270 top

### Tracks (layer width: path | path; a pad name or v marks a point on that pad's centre or on a via)
3V3  (via drill 0.35)
  Top 0.203: 64.9,43.56 60.45,39.12 49.07,39.12 U1.1 48.9,39.12 48.01,39.12 47.65,39.47 v47.65,43.2 | 64.9,43.56 64.9,45.52 C4.2 | 64.9,43.56 70.59,43.56 72.72,41.43 72.72,39.29 71.12,37.69 R29.1 | U1.64 47.12,37.34 47.12,38.05 46.23,38.94 45.52,38.94 45.52,39 | U$3.4 58.32,66.14 58.32,65.79 U$3.3 58.14,65.79 57.78,65.43 57.78,64.54 U$3.28 57.78,64.36 57.78,64.01 59.74,62.05 | 59.74,62.05 60.81,62.05 C18.2 | 64.01,68.99 63.12,69.88 R24.2 | 64.01,68.99 64.01,59.21 62.23,57.43 59.74,57.43 | 59.74,57.43 50.32,57.43 46.44,53.56 | 46.44,53.56 46.23,53.34 46.23,50.49 | 46.23,50.49 46.23,48.54 U1.19 46.23,48.36 46.23,47.65 45.52,46.94 v45.52,46.58 45.52,39 | U1.32 39.65,48.54 39.65,50.15 40,50.5 40.01,50.49 46.23,50.49 | v46.58,45.52 47.12,44.98 48.9,44.98 U1.13 | v59.74,60.63 59.74,62.05 | 59.74,57.43 v59.74,58.85 | 65.96,28.5 65.96,28.09 U3.18 | 65.96,28.5 65.96,28.63 65.61,28.98 64.72,28.98 64.54,28.8 64.54,28.09 U3.20 64.36,27.91 64.36,22.12 63.65,21.41 63.65,19.74 U3.4 | 63.65,19.02 63.65,19.56 U3.4 | 63.65,19.02 64.01,18.67 64.9,18.67 65.08,18.85 65.08,19.56 U3.6 | 29.69,12.8 29.69,13.34 X1.3 29.69,12.8 | 32.72,9.78 33.96,8.53 52.98,8.53 57.25,12.8 57.25,13.34 X4.8 57.25,13.51 59.74,16 59.74,18.49 59.92,18.67 63.3,18.67 63.65,19.02 | 32.72,9.78 29.69,12.8 | v36.27,11.91 34.85,11.91 32.72,9.78 | 63.65,19.02 U3.4 | 14.76,71.83 15.47,71.12 R3.2 | 14.76,71.83 14.05,72.54 14.05,73.43 R8.2 14.05,73.61 15.29,74.85 15.29,80.37 14.94,80.72 13.51,80.72 12.8,81.43 12.8,83.39 12.98,83.57 19.02,83.57 20.8,81.79 27.03,81.79 30.4,78.41 31.47,78.41 JP2.12 31.65,78.23 31.65,75.74 JP2.11 31.65,75.56 33.25,73.97 62.76,73.97 66.5,70.23 66.5,69.7 65.79,68.99 64.01,68.99
  Top 0.203: 15.47,29.34 15.47,29.52 10.31,34.67 10.31,45.34 13.87,48.9 | 15.47,29.34 15.47,27.03 R17.2 | 13.87,48.9 15.47,48.9 R12.2 | 14.76,71.83 10.31,67.39 10.31,52.45 13.87,48.9 | 29.69,12.8 28.98,12.09 26.67,12.09 26.31,12.45 26.31,19.74 28.8,22.23 28.8,27.91 27.38,29.34 15.47,29.34 | U1.48 41.41,39.05 42.24,39.88 44.63,39.88 45.52,39 | C19.1 45.84,53.56 46.44,53.56 | C8.1 76.6,27.65 v76.5,27.75 | 65.96,28.5 66.01,28.5 66.44,28.93 67.16,28.93 67.31,28.79 67.31,28.56 v67.62,28.25
  Bottom 0.203: v45.52,46.58 v46.58,45.52 46.58,44.27 v47.65,43.2 | v59.74,58.85 v59.74,60.63 | v36.27,11.91 36.63,12.27 36.63,13.34 X2.2 36.63,13.51 36.63,14.76 37.34,15.47 49.96,15.47 50.49,14.94 50.49,13.51 X6.2 | v76.5,27.75 70.25,27.75 69.43,26.93 68.9,26.93 68.53,27.3 68.53,27.34 v67.62,28.25
5V
  Top 0.203: JP2.9 28.98,75.74 28.98,78.23 JP2.10
BAT+  (via drill 0.35)
  Top 0.203: R7.2 14.05,82.32 19.74,82.32 23.47,78.59 JP2.6
  Top 1.27: D1.A 31.02,51.28 32.06,50.25 32.06,47.75 31.02,46.72 D3.A 31.02,29.28 32.06,28.25 32.06,25.75 31.02,24.72 D4.A | JP2.6 JP2.5 26.94,72.74 31.57,72.74 32.06,72.25 32.06,69.75 31.02,68.72 D1.A | D1.A 31.23,67.2 C7.+ 37.26,67.2 41.6,71.54 63.93,71.54 v65.46,70
  Bottom 1.27: v65.46,70 J1.4
BAT+RTF1
  Top 0.406: 24.39,64.41 24,64.03 IC1.11
  Top 1.016: D1.C 26.98,66.74 | D1.C 26.98,68.42 C5.2 | D1.C 24.39,64.41 24.39,64.16 24.26,64.03
BAT+RTF2
  Top 0.406: 24.39,42.41 24,42.02 IC4.11
  Top 1.016: D3.C 26.98,44.74 | D3.C 26.98,46.42 C9.2 | D3.C 24.39,42.41 24.39,42.16 24.26,42.02
BAT+RTF3
  Top 0.406: 24.39,20.41 24,20.02 IC5.11
  Top 1.016: D4.C 26.98,22.74 | D4.C 26.98,24.43 C11.2 | D4.C 24.39,20.41 24.39,20.16 24.26,20.02
BLUE_RGB
  Top 0.203: R31.1 71.83,26.31 71.48,26.31 67.74,30.05 61.87,30.05 58.85,27.03 58.85,26.31 59.21,25.96 59.74,25.96 U3.26
BOOT0
  Top 0.203: U1.60 45.16,37.16 45.16,35.56 41.96,32.36 39.12,32.36 R1.2 38.94,32.54 35.56,29.16 35.56,20.45 33.43,18.31 33.43,13.51 X1.6
CE01  (via drill 0.35)
  Top 0.203: v35.92,38.05 36.27,38.41 43.92,38.41 44.09,38.23 44.09,37.34 U1.58 | v28.63,45.34 28.63,47.83 28.98,48.18 v28.98,71.12
  Bottom 0.203: v28.63,45.34 v35.92,38.05 | v28.98,71.12 32.89,75.03 32.89,78.94 33.6,79.65 35.2,79.65 36.63,78.23 JP2.16
CE11  (via drill 0.35)
  Top 0.203: v69.16,27.56 69.16,25.43 68.81,25.07 68.28,25.07 U3.14 | v71.83,35.56 71.83,36.27 73.08,37.52 73.08,61.87 67.21,67.74 67.21,70.59 63.12,74.68 61.52,74.68 60.63,75.56 60.63,76.1 59.92,76.81 45.34,76.81 44.27,75.74 JP2.21
  Bottom 0.203: v69.16,27.56 69.16,32.89 v71.83,35.56
COM1  (via drill 0.35)
  Top 0.406: R4.2 R5.2 R2.2 v21.84,62 | v21.74,65.19 21.91,65.19 22.03,65.31 22.92,65.31 IC1.13
  Bottom 0.406: v21.84,62 21.74,62.11 v21.74,65.19
COM2  (via drill 0.35)
  Top 0.406: R15.2 R16.2 R14.2 v21.84,40 | v21.74,43.19 21.91,43.19 22.03,43.31 22.92,43.31 IC4.13
  Bottom 0.406: v21.84,40 21.74,40.11 v21.74,43.19
COM3  (via drill 0.35)
  Top 0.406: R20.2 R21.2 R19.2 v21.84,18 | v21.74,21.18 21.91,21.18 22.03,21.31 22.92,21.31 IC5.13
  Bottom 0.406: v21.84,18 21.74,18.11 v21.74,21.18
CPN1
  Top 0.406: IC1.6 17.04,64.01 15.16,64.01 14.75,63.6 C6.1
CPN2
  Top 0.406: IC4.6 17.04,42.01 15.16,42.01 14.75,41.6 C10.1
CPN3
  Top 0.406: IC5.6 17.04,20.01 15.16,20.01 14.75,19.6 C12.1
CPP1
  Top 0.406: C6.2 15.34,66.4 15.92,65.82 15.92,64.93 16.16,64.69 17.04,64.69 IC1.5
CPP3
  Top 0.406: C12.2 15.34,22.4 15.92,21.82 15.92,20.93 16.16,20.69 17.04,20.69 IC5.5
CPP12
  Top 0.406: C10.2 15.34,44.4 15.92,43.82 15.92,42.93 16.16,42.69 17.04,42.69 IC4.5
CS1
  Top 0.406: IC1.14 22.96,65.99 23.84,65.99 24.08,66.23 24.08,68.59 23.19,69.48 23.19,72.52 23.43,72.76 25.37,72.76 27.12,71 R6.2
CS2
  Top 0.406: IC4.14 22.96,43.99 23.84,43.99 24.08,44.23 24.08,46.59 23.19,47.48 23.19,50.52 23.43,50.76 25.37,50.76 27.12,49 R13.2
CS3
  Top 0.406: IC5.14 22.96,21.99 23.84,21.99 24.08,22.23 24.08,24.59 23.19,25.48 23.19,28.52 23.43,28.76 25.37,28.76 27.12,27 R18.2
DIG1
  Top 0.203: SJ7.2 49.07,54.76 52.81,54.76 55.12,57.07 62.41,57.07 66.85,61.52 66.85,70.41 62.94,74.32 60.81,74.32 59.56,75.56 JP2.33
DIR1  (via drill 0.35)
  Top 0.203: v33.43,26.49 33.43,32.89 32.36,33.96 32.36,39.47 34.49,41.6 34.49,41.96 SJ8.1 34.67,42.14 33.96,42.85 v33.96,43.74 | v21.51,67.21 22.05,66.67 22.94,66.67 IC1.15 | v36.09,42.14 37.69,42.14 U1.42
  Bottom 0.203: v33.43,26.49 33.78,26.14 34.31,26.14 SJ2.1 | v21.51,67.21 21.51,66.85 33.96,54.41 v33.96,43.74 34.49,43.74 v36.09,42.14
DIR2  (via drill 0.35)
  Top 0.203: v41.6,33.07 41.6,34.14 43.74,36.27 43.74,37.16 U1.57 | v21.51,45.16 22.05,44.63 IC4.15
  Bottom 0.203: v41.6,33.07 41.6,28.45 41.25,28.09 41.07,28.09 36.09,23.11 35.2,23.11 34.49,22.4 34.49,22.05 SJ4.1 34.31,21.87 33.96,21.87 32.72,23.11 32.72,33.6 21.51,44.81 v21.51,45.16
DIR3  (via drill 0.35)
  Top 0.203: v21.51,23.11 21.87,22.76 22.94,22.76 IC5.15 | v32,19.38 34.14,21.51 34.14,26.85 33.78,27.2 33.78,38.41 36.98,41.6 37.69,41.6 U1.43
  Bottom 0.203: 31.83,19.2 31.29,19.74 24.89,19.74 v21.51,23.11 | 31.83,19.2 33.07,17.96 34.31,17.96 SJ6.1 | 31.83,19.2 v32,19.38
DIR_2_AT  (via drill 0.35)
  Top 0.203: v66.32,24.54 65.79,24 65.79,23.11 66.14,22.76 68.1,22.76 U3.11
  Bottom 0.203: v66.32,24.54 66.14,24.54 55.47,35.2 44.98,35.2 44.09,34.31 44.09,30.05 36.09,22.05 35.74,22.05 SJ4.2
DIR_3_AT  (via drill 0.35)
  Top 0.203: v49.96,25.96 51.56,25.96 51.74,26.14 55.65,26.14 v59.56,30.05 | v66.5,23.47 68.1,23.47 U3.12
  Bottom 0.203: v49.96,25.96 47.83,25.96 47.47,25.6 47.47,25.07 40.36,17.96 35.74,17.96 SJ6.2 | v59.56,30.05 66.14,23.47 v66.5,23.47
GND  (via drill 0.35)
  Top 0.203: v42.5,39.25 44.6,39.25 45.6,38.25 46.41,38.25 46.58,38.08 46.58,37.27 U1.63
  other vias: 65,53 67,56 59,51 61.25,58.5 49,58 46.75,56 54.25,61.75 48.25,63 48.25,66.25 50.75,69.25 45.25,69.5 41.5,63 41.75,61 43.75,66.25 43.5,62 36.75,62.25 35.5,63.75 33,64 33,60.25 34.5,57.75 29.75,63.75 29.75,62.5 32.75,21.5 31.5,21 31.5,15.75 32.25,16.5 39.25,16.5 43.75,16.5 43.75,14 28.5,17.25 29.75,18.25 27.5,16.25 46.25,18.75 48.5,20.75 55.25,16.25 56,18.5 57.5,19.25 62.25,22 62.25,23.25 67.25,17.5 73.25,19.5 74.75,17.5 73.25,18 73.5,16.25 68,15.75 66.5,32 68.5,35 74,36 78.75,34.5 78.75,48.25 79,15.5 62.75,34 63.5,35.25 68.75,42.25 70,42.5 68.25,45 70.5,45 48.75,48.5 50.5,50.5 51,49 53.75,51.75 57,50.5 42.5,41 40,42.5 42,43.25 41,40.25 16.5,37.25 11.75,39.5 12,36.5 12.5,27.25 11.75,30 8.5,26.5 6.25,34 7,30.5 5.75,14.25 11,13.75 24.5,15.5 5.5,49 7.5,41.5 7.75,56.75 6.25,65.75 9,69.75 16.25,59.25 11.75,61 11.75,57 29.25,29.75 25,34.75 24.75,31.75 24.75,38.5 27.5,34.25 29,32.5 27.75,40.5 29.25,39.25 40.75,31 43,32.25 62,25.25 62.25,17.25 57.75,15.5 43.5,26 40.5,23.25 38.25,22.25 45.5,29 47.5,32 42.5,29.5 41.75,49.75 50.5,45 51.25,65.25 51.75,64.5
  pour Top: 64,0 83,0 arc90 86,3 86,13.5 arc90 84.5,15 arc-90 83,16.5 83,69.5 arc-90 84.5,71 arc90 86,72.5 86,83 arc90 83,86 62.5,86 arc90 61,84.5 arc-90 59.5,83 26.5,83 arc-90 25,84.5 arc90 23.5,86 3,86 arc90 0,83 0,72.5 arc90 1.5,71 arc-90 3,69.5 3,16.5 arc-90 1.5,15 arc90 0,13.5 0,3 arc90 3,0 22,0 arc90 25,3 arc-90 28,6 58,6 arc-90 61,3 arc90
  pour Bottom: 64,0 83,0 arc90 86,3 86,13.5 arc90 84.5,15 arc-90 83,16.5 83,69.5 arc-90 84.5,71 arc90 86,72.5 86,83 arc90 83,86 62.5,86 arc90 61,84.5 arc-90 59.5,83 26.5,83 arc-90 25,84.5 arc90 23.5,86 3,86 arc90 0,83 0,72.5 arc90 1.5,71 arc-90 3,69.5 3,16.5 arc-90 1.5,15 arc90 0,13.5 0,3 arc90 3,0 22,0 arc90 25,3 arc-90 28,6 58,6 arc-90 61,3 arc90
GREEN_RGB  (via drill 0.35)
  Top 0.203: v69.7,21.69 71.83,21.69 R30.1 | 59.92,26.49 U3.25 60.17,26.34 60.74,26.34 61.37,25.71 61.37,24.99 61.74,24.62 61.9,24.62 63.05,23.47 v63.65,23.47
  Bottom 0.203: v69.7,21.69 68.99,22.4 64.72,22.4 v63.65,23.47
I2CADDR_3V
  Top 0.203: R23.1 50.25,64.7 50.25,65.75 50.75,66.25 U$3.17
MCO
  Top 0.203: U1.5 49.07,41.07 49.96,41.07 51.21,42.32 51.21,43.74 51.13,43.81 51.13,45.73 49.78,47.08 49.78,47.12 47.12,47.12 45.87,45.87 45.87,39.83 48.9,36.8 48.9,24.89 45.34,21.34 40.54,21.34 34.85,15.65 34.85,13.69 34.67,13.51 X1.7
MISO1  (via drill 0.35)
  Top 0.203: v44.81,41.43 44.81,47.3 44.63,47.47 44.63,48.36 U1.22 44.63,48.54 44.63,49.25 v44.09,49.78 | 68.1,26.67 U3.16 68.25,26.75 68.25,29 67.91,29.34 v62.41,29.34 | v51.74,19.74 48.72,16.71 48.72,13.51 X4.1 | v58.5,33.25 v52.09,26.85
  Bottom 0.203: v62.41,29.34 v58.5,33.25 54.76,36.98 49.25,36.98 v44.81,41.43 | v51.74,19.74 53.16,21.16 53.16,25.78 v52.09,26.85 | v44.09,49.78 34.14,59.74 34.14,75.56 JP2.13
MOSI1  (via drill 0.35)
  Top 0.203: v65.79,21.66 65.43,22.01 65.43,24.71 66.5,25.78 68.1,25.78 U3.15 | v50.32,10.31 50.32,12.98 49.96,13.34 X4.2 | 41.96,45.34 41.6,44.98 40.72,44.98 38.76,46.94 38.76,64.36 41.25,66.85 41.25,69.16 v41.07,69.34 | 41.96,45.34 44.09,47.47 44.09,48.36 U1.23 | 41.96,45.34 v44.09,43.2
  Bottom 0.203: 65.79,20.98 65.79,17.78 55.83,7.82 52.45,7.82 50.32,9.96 v50.32,10.31 | v41.07,69.34 35.2,75.21 35.2,76.28 35.38,76.45 35.38,76.99 34.14,78.23 JP2.14 | 65.79,20.98 70.05,20.98 70.41,21.34 70.41,23.82 56.9,37.34 49.96,37.34 v44.09,43.2 | 65.79,20.98 v65.79,21.66
N$3
  Top 0.203: U1.3 49.07,40.01 54.94,40.01 56.54,41.6 Y1.P$4 56.72,41.78 56.9,41.96 56.9,45.52 C3.2
N$4  (via drill 0.35)
  Top 0.203: v38.05,50.32 34.85,50.32 33.07,48.54 33.07,47.47 32.72,47.12 32.72,44.27 33.25,43.74 33.25,42.14 SJ8.2 | v51.38,53.16 61.34,53.16 v70.94,62.76
  Bottom 0.203: v38.05,50.32 39.12,50.32 40.72,48.72 46.94,48.72 47.11,48.89 v51.38,53.16 | v70.94,62.76 72.01,63.83 72.36,63.83 J1.1
N$5
  Top 0.203: U1.4 49.07,40.54 52.27,40.54 53.34,41.6 Y1.P$1 53.34,41.78 53.16,41.96 53.16,45.52 C2.2
N$6  (via drill 0.35)
  Top 0.203: v38.05,49.25 34.31,49.25 33.43,48.36 33.43,45.16 SJ9.2
  Bottom 0.203: v38.05,49.25 39.12,49.25 49.96,38.41 49.96,38.05 50.32,37.69 52.45,37.69 70.23,55.47 70.23,64.01 72.36,66.14 J1.2
N$7
  Top 0.203: LED1.A 10.13,79.3 13.69,79.3 13.87,79.48 R7.1
N$8
  Top 0.203: U3.8 66.85,19.56 68.45,17.96 69.34,17.96 C14.1 69.52,17.78 69.52,16.71 71.83,14.4 Q2.2
N$9
  Top 0.203: Y2.P$4 57.25,60.1 U$3.27
  Top 0.406: C15.2 61.05,59.75 Y2.P$4
N$10
  Top 0.203: Y2.P$1 54.4,60.4 56.84,62.84 56.84,64.05 56.82,64.07 56.82,64.37 U$3.26
  Top 0.406: C16.2 54.4,60 Y2.P$1
N$11
  Top 0.203: C17.2 58.61,68 58.5,68.11 57,68.11 56.82,67.93 56.82,67.63 U$3.9
N$12
  Top 0.203: Q2.1 62.23,14.4 60.63,16 60.63,17.78 C13.1 60.63,17.96 64.9,17.96 65.96,19.02 65.96,19.56 U3.7
N$13
  Top 0.203: R30.2 73.79,21.87 73.79,22.58 74.85,23.65 74.85,28.27 73.79,29.34 LED2.3
N$14
  Top 0.203: R31.2 73.61,26.31 73.25,26.31 70.23,29.34 LED2.1
N$15
  Top 0.203: R32.2 73.79,24 73.79,24.89 74.5,25.6 74.5,26.85 73.25,28.09 73.08,28.09 71.83,29.34 LED2.2
N$16
  Top 0.203: LED3.A 10.13,76.63 13.69,76.63 13.87,76.45 R8.1
NRESET_3V
  Top 0.203: R24.1 59.56,68.51 56.41,68.51 55.82,67.93 55.82,67.63 U$3.11
NRST  (via drill 0.35)
  Top 0.203: 55.12,48.36 55.83,47.65 55.83,47.47 56.54,46.76 59.92,46.76 60.98,45.7 C1.2 60.98,45.52 60.98,42.32 S1.2 | 55.12,48.36 50.14,53.34 49.07,53.34 SJ7.1 | v50.49,43.13 50.49,42.67 49.96,42.14 49.07,42.14 U1.7 | v51.81,44.2 51.81,46.48 52.63,47.3 54.05,47.3 55.12,48.36 | v41.96,20.62 40.36,20.62 35.92,16.18 35.92,13.51 X1.8 | v49.96,27.74 49.96,30.23 49.78,30.4 49.78,37.52 v50.67,38.41
  Bottom 0.203: v51.81,44.2 v50.49,43.13 50.67,43.2 v50.67,38.41 | v41.96,20.62 48.36,27.03 49.25,27.03 v49.96,27.74
PS0_3V
  Top 0.203: R11.1 59.49,67.56 U$3.6
PS1_3V
  Top 0.203: U$3.5 58.31,66.74 58.37,66.68 58.63,66.68 58.8,66.5 58.8,66.25 R22.1
PWM_SPEED1  (via drill 0.35)
  Top 0.203: v33.07,34.31 33.07,38.94 35.38,41.25 35.38,44.09 | 35.38,44.09 35.38,44.27 34.67,44.98 SJ9.1 34.67,45.16 v34.67,48.54 | v23.11,68.1 23.11,67.39 IC1.16 | 35.38,44.09 37.69,44.09 U1.38
  Bottom 0.203: v33.07,34.31 34.49,32.89 34.49,28.09 SJ3.1 | v23.11,68.1 23.11,65.79 34.67,54.23 v34.67,48.54
PWM_SPEED2  (via drill 0.35)
  Top 0.203: v41.07,45.7 41.07,48.36 U1.29 | v23.29,46.05 23.11,45.87 23.11,45.34 IC4.16
  Bottom 0.203: 37.69,41.43 37.69,42.32 v41.07,45.7 | 37.69,41.43 37.69,26.67 36.09,25.07 35.2,25.07 34.49,24.36 34.49,24 SJ1.1 | v23.29,46.05 30.58,46.05 35.2,41.43 37.69,41.43
PWM_SPEED3  (via drill 0.35)
  Top 0.203: v23.29,24.18 23.29,23.47 23.11,23.29 IC5.16 | v40.54,33.07 40.54,33.6 43.2,36.27 43.2,37.16 U1.56 | v38.41,30.94 38.23,30.94 35.92,28.63 35.92,19.56 v36.45,19.02
  Bottom 0.203: v23.29,24.18 27.38,20.09 34.31,20.09 SJ5.1 34.31,19.91 35.2,19.02 36.09,19.02 36.27,19.2 v36.45,19.02 | v38.41,30.94 v40.54,33.07
RED_RGB
  Top 0.203: R32.1 71.83,23.82 70.76,23.82 68.81,21.87 68.28,21.87 U3.10
RESET  (via drill 0.35)
  Top 0.203: 51.38,23.47 51.03,23.47 50.67,23.82 50.67,24.54 51.92,25.78 56.36,25.78 65.96,35.38 65.96,35.74 RESET1.2 66.14,35.92 70.59,40.36 70.94,40.36 R29.2 | 51.38,23.47 59.74,23.47 U3.29 | v52.45,21.51 52.45,13.51 X4.4 | 51.38,23.47 v51.38,22.58
  Bottom 0.203: v51.38,22.58 v52.45,21.51
RX
  Top 0.203: U3.30 59.74,22.58 52.45,22.58 47.83,17.96 47.83,11.73 50.32,9.25 51.74,9.25 54.76,12.27 54.76,13.34 X4.6
SCK1  (via drill 0.35)
  Top 0.203: v64.72,21.41 64.72,24.54 66.67,26.49 66.67,27.91 U3.17 | v51.38,9.96 51.38,13.16 51.21,13.34 X4.3 | v45.16,49.78 45.16,48.54 U1.21 | v64.19,17.25 64.72,17.25 68.99,12.98 74.68,12.98 75.56,13.87 75.56,68.81 67.21,77.17 38.23,77.17 36.8,75.74 JP2.15
  Bottom 0.203: v64.72,21.41 64.72,17.25 64.36,16.89 | 64.36,16.89 55.65,8.18 53.16,8.18 v51.38,9.96 | v45.16,49.78 45.16,67.21 36.8,75.56 JP2.15 | 64.36,16.89 64.36,17.07 v64.19,17.25
SCL3  (via drill 0.35)
  Top 0.203: v55.3,66.67 53.87,65.25 U$3.19 | v61.16,21.16 61.16,23.65 60.63,24.18 59.92,24.18 U3.28 | v45.52,34.14 45.7,34.31 45.7,37.16 U1.61 | v41.96,12.8 41.43,13.34 40.89,13.34 X1.12 | v52.09,38.41 52.09,33.78 v50.49,32.18
  Bottom 0.203: JP2.32 56.9,78.23 58.14,76.99 58.14,75.03 55.3,72.19 v55.3,66.67 55.3,41.6 v52.09,38.41 | 48.01,12.8 48.01,13.34 X6.4 48.01,12.8 | 48.01,12.8 48.01,12.45 48.72,11.73 52.45,11.73 61.16,20.45 v61.16,21.16 50.32,32 | v45.52,34.14 48.18,34.14 50.32,32 | 48.01,12.8 v41.96,12.8 39.83,12.8 37.52,10.49 35.03,10.49 34.14,11.38 34.14,13.34 X2.4 | 50.32,32 v50.49,32.18
SDA3  (via drill 0.35)
  Top 0.203: v52.81,65.25 52.98,65.25 53.7,64.54 U$3.20 53.7,64.36 53.7,62.94 52.25,61.5 45.75,61.5 39.12,54.87 39.12,47.47 39.65,46.94 v40.36,46.94 | v51.38,24.18 52.09,24.89 59.74,24.89 U3.27 | v50.32,23.11 48.72,23.11 43.74,18.14 | 43.74,18.14 39.65,14.05 39.65,13.51 X1.11 39.47,13.34 39.47,12.8 37.87,11.2 v35.38,11.2 | 46.23,36.09 46.23,30.76 48.54,28.45 48.54,25.6 v48.18,25.25 | 46.23,36.09 46.23,37.16 U1.62 | 43.74,18.14 v47.12,14.76 | v48.01,36.63 47.47,36.09 46.23,36.09
  Bottom 0.203: v52.81,65.25 52.81,71.48 56.9,75.56 JP2.31 | v51.38,24.18 v50.32,23.11 v48.18,25.25 | v35.38,11.2 35.38,13.34 X2.3 | v47.12,14.76 47.47,15.11 49.07,15.11 49.25,14.94 49.25,13.51 X6.3 | v40.36,46.94 40.89,46.94 43.38,44.45 43.38,41.25 v48.01,36.63
SET_TYPE
  Top 0.406: R3.1 17.06,69.64 IC1.1
SET_TYPE2
  Top 0.406: R12.1 17.06,47.64 IC4.1
SET_TYPE3
  Top 0.406: R17.1 17.06,25.64 IC5.1
SP_1  (via drill 0.35)
  Top 0.203: v47.83,28.09 v36.63,28.09 | v50.49,30.76 53.52,30.76 63.48,40.72 68.99,40.72 69.88,41.6 72.01,41.6 72.36,41.25 72.36,39.47 71.65,38.76 69.88,38.76 69.7,38.58 69.7,36.63 71.48,34.85 74.32,34.85 75.21,33.96 75.21,21.87 74.32,20.98 68.28,20.98 U3.9
  Bottom 0.203: v36.63,28.09 35.74,28.09 SJ3.2 | v50.49,30.76 v47.83,28.09
SP_2  (via drill 0.35)
  Top 0.203: v69.52,23.65 68.99,24.18 68.28,24.18 U3.13 | v40.89,28.8 44.81,32.72 v44.81,33.43
  Bottom 0.203: v40.89,28.8 36.09,24 35.74,24 SJ1.2 | v44.81,33.43 44.81,34.49 45.16,34.85 53.7,34.85 65.79,22.76 68.63,22.76 v69.52,23.65
SP_3  (via drill 0.35)
  Top 0.203: v58.32,21.16 59.74,19.74 61.16,19.74 U3.1
  Bottom 0.203: v58.32,21.16 58.32,21.69 51.56,28.45 49.61,28.45 48.54,27.38 47.65,27.38 40.36,20.09 35.74,20.09 SJ5.2
SWO  (via drill 0.35)
  Top 0.203: v36.27,30.94 36.27,31.83 38.05,33.6 40.01,33.6 42.67,36.27 42.67,37.16 U1.55 | v36.98,27.03 36.98,19.56 37.16,19.38 37.16,18.67 v34.14,15.65 | v32.72,15.11 32.72,14.05 32.18,13.51 X1.5
  Bottom 0.203: v36.27,30.94 36.27,29.52 37.34,28.45 37.34,27.38 v36.98,27.03 | v34.14,15.65 33.6,15.11 v32.72,15.11
TCK
  Top 0.203: U1.49 39.65,37.16 38.58,37.16 34.49,33.07 34.49,20.45 29.16,15.11 28.09,15.11 27.2,14.22 27.2,13.51 X1.1
TMS  (via drill 0.35)
  Top 0.203: v34.49,34.14 34.49,37.69 36.8,40.01 37.69,40.01 U1.46 | v35.56,33.07 35.56,29.69 34.85,28.98 34.85,20.27 29.34,14.76 28.98,14.76 28.45,14.22 28.45,13.51 X1.2
  Bottom 0.203: v35.56,33.07 v34.49,34.14
TX
  Top 0.203: U3.31 59.74,21.87 57.96,21.87 53.7,17.6 53.7,13.51 X4.5
U1
  Top 0.406: 22.96,63.36 IC1.10 22.92,63.36 22.03,63.36 21.69,63.02 20.22,61.54 20.22,58.64 R5.1
  Top 0.61: 21.69,63.02 21.56,62.89 21.48,62.89 19.89,61.3 19.89,58.89 18,57 X5.2
U2
  Top 0.406: 22.96,41.36 IC4.10 22.92,41.36 22.03,41.36 21.69,41.02 20.22,39.54 20.22,36.64 R16.1
  Top 0.61: 21.69,41.02 21.56,40.89 21.48,40.89 19.89,39.3 19.89,36.89 18,35 X7.2
U3
  Top 0.406: 22.96,19.36 IC5.10 22.92,19.36 22.03,19.36 21.69,19.02 20.22,17.54 20.22,14.64 R21.1
  Top 0.61: 21.69,19.02 21.56,18.89 21.48,18.89 19.89,17.3 19.89,14.89 18,13 X8.2
USART_RX  (via drill 0.35)
  Top 0.203: v29.69,60.27 29.69,50.49 29.34,50.14 29.34,44.9 26.5,42.07 26.5,33.5 29.88,30.12 29.88,29.49 29.34,28.94 29.34,20.62 v31.47,18.49 | v36.63,15.82 36.63,13.87 36.98,13.51 X1.9 | U1.17 47.12,48.54 47.19,48.61 v47.19,51.28
  Bottom 0.203: 46,49.07 40.89,49.07 v29.69,60.27 | 46,49.07 46.23,49.07 | v31.47,18.49 32,18.49 34.14,16.36 36.09,16.36 v36.63,15.82 | 46,49.07 46.75,49.82 46.75,51.25 46.78,51.28 v47.19,51.28
USART_TX  (via drill 0.35)
  Top 0.203: v47.65,45.7 47.65,46.05 48.18,46.58 48.9,46.58 U1.16 | v47.65,44.27 46.94,43.56 46.94,39.29 49.25,36.98 49.25,24.71 39.29,14.76 39.12,14.76 38.41,14.05 38.41,13.51 X1.10
  Bottom 0.203: v47.65,44.27 v47.65,45.7
V1
  Top 0.406: IC1.9 22.66,62.44 22.63,62.41 22.63,55.93 21.42,54.72 R4.1
  Top 0.61: X5.3 15.7,54.46 17.57,52.59 19.59,52.59 22.73,55.73 22.73,62.43 22.94,62.64 22.86,62.64 22.66,62.44
V2
  Top 0.406: IC4.9 22.66,40.44 22.63,40.41 22.63,33.93 21.42,32.72 R15.1
  Top 0.61: X7.3 15.7,32.46 17.57,30.59 19.59,30.59 22.73,33.73 22.73,40.43 22.94,40.64 22.86,40.64 22.66,40.44
V3
  Top 0.406: IC5.9 22.66,18.44 22.63,18.41 22.63,11.93 21.42,10.72 R20.1
  Top 0.61: X8.3 15.7,10.46 17.57,8.59 19.59,8.59 22.73,11.73 22.73,18.43 22.94,18.64 22.86,18.64 22.66,18.44
VCP1
  Top 0.406: C5.1 21.6,69.86 18.79,67.05 18.63,67.05 18.21,66.63 18.21,65.58 17.97,65.34 17.08,65.34 IC1.4
VCP2
  Top 0.406: C9.1 21.6,47.86 18.79,45.05 18.63,45.05 18.21,44.63 18.21,43.58 17.97,43.34 17.08,43.34 IC4.4
VCP3
  Top 0.406: C11.1 21.6,25.86 18.79,23.05 18.63,23.05 18.21,22.63 18.21,21.58 17.97,21.34 17.08,21.34 IC5.4
W1
  Top 0.406: R2.1 18.21,60.37 18.21,63.12 17.97,63.36 17.08,63.36 IC1.7 16.18,63.38 15.92,63.12 15.92,62.99 15.82,62.89
  Top 0.61: X5.1 16,61.54 16,62.11 15.82,62.29 15.82,62.89
W2
  Top 0.406: R14.1 18.21,38.37 18.21,41.12 17.97,41.36 17.08,41.36 IC4.7 16.18,41.38 15.92,41.12 15.92,40.99 15.82,40.89
  Top 0.61: X7.1 16,39.54 16,40.11 15.82,40.29 15.82,40.89
W3
  Top 0.406: R19.1 18.21,16.37 18.21,19.12 17.97,19.36 17.08,19.36 IC5.7 16.18,19.38 15.92,19.12 15.92,18.99 15.82,18.89
  Top 0.61: X8.1 16,17.54 16,18.11 15.82,18.29 15.82,18.89